# Altium schematic sheet I2C_Shield.SchDoc: I2C_Shield
size A3; Date: 23.01.2025; CheckedBy: Enes Şen; Author: Enes Şen; DrawnBy: Enes Şen; Engineer: Enes Şen; Address1: Balıkesir; DocumentNumber: 1; Revision: 1.0; SheetNumber: 1; SheetTotal: 1; Time: 18:19; ImagePath: 1; Rule: UNIONINDEX=0|RULEKIND=Clearance|NETSCOPE=DifferentNets|LAYERKIND=SameLayer|NAME=Schematic Clearance Constraint|GAP=10mil|GENERICCLEARANCE=10mil|IGNOREPADTOPADCLEARANCEINFOOTPRINT=FALSE|OBJECTCLEARANCES= |UNIT=Imperial
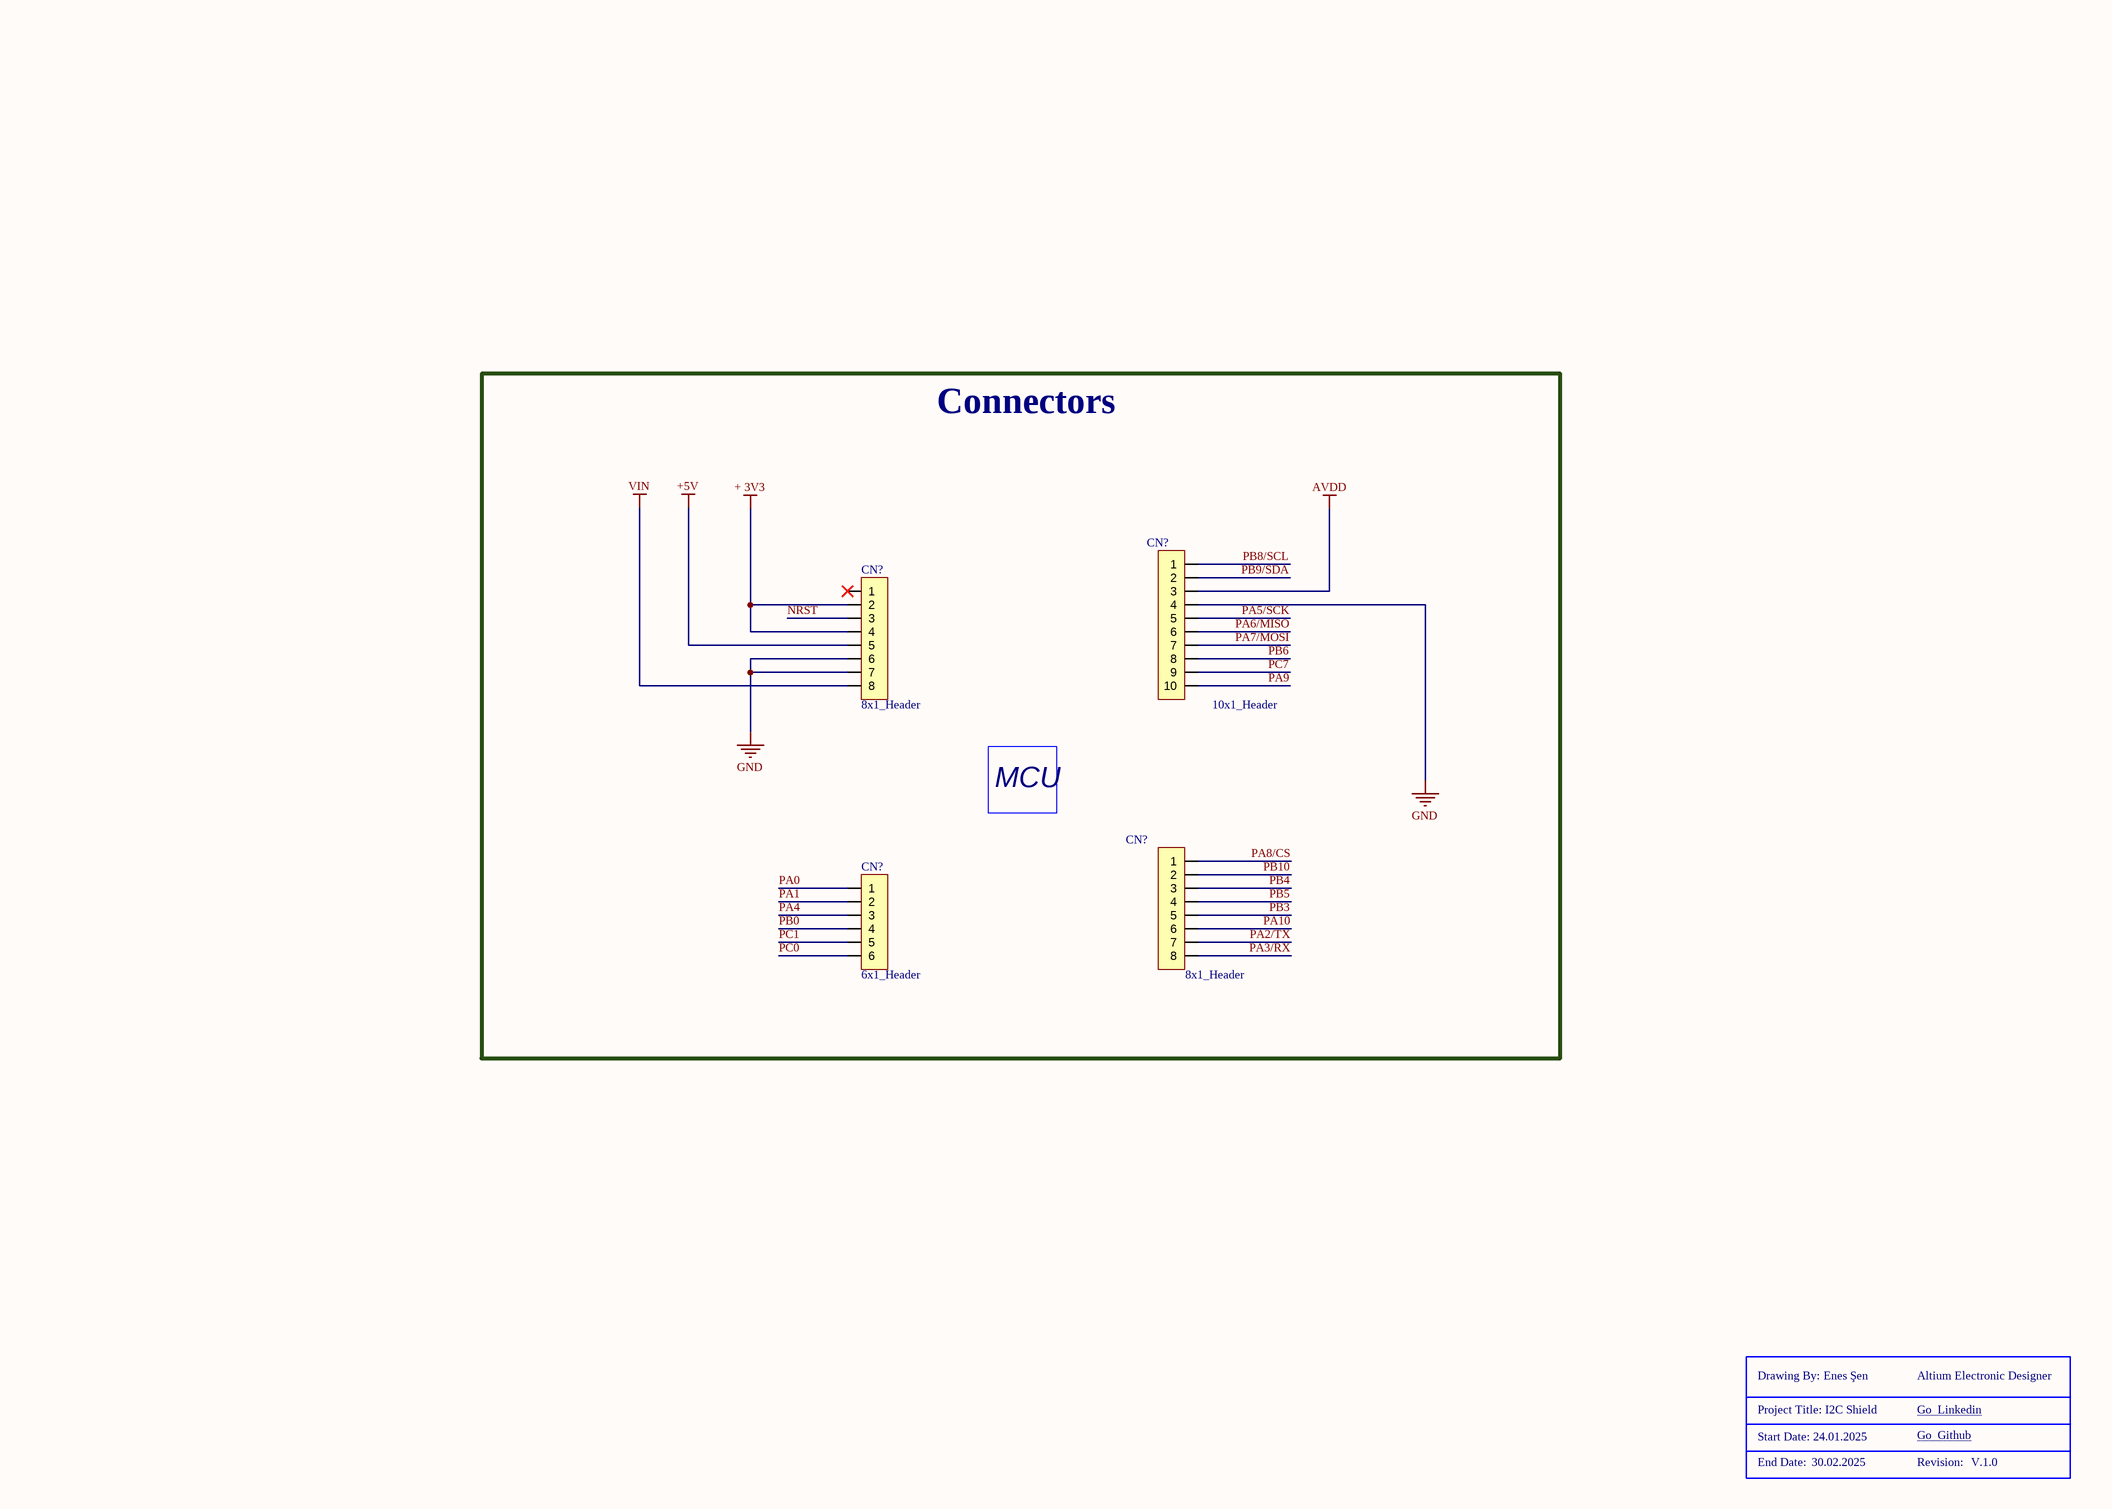
[diagram p0: I2C_Shield.SchDoc]

## Parts
(Parts that share a designator on the sheet are numbered #1, #2 ... from top to bottom, then left to right.)
*  Title_Block  (value not drawn)  (graphical)
CN?#1  Header_10*1_2.54_2  (value not drawn)
CN?#2  Header_8*1_2.54  (value not drawn)
CN?#3  Header_8*1_2.54  (value not drawn)
CN?#4  Header_6*1_2.54  (value not drawn)

## Blocks framed on the sheet
Connectors: CN?#1-CN?#4

## Nets
+5V: CN?#2.5
+ 3V3: CN?#2.2 CN?#2.4
AVDD: CN?#1.3
GND: CN?#1.4 CN?#2.6 CN?#2.7
VIN: CN?#2.8
NRST: CN?#2.3
PA0: CN?#4.1
PA1: CN?#4.2
PA2/TX: CN?#3.7
PA3/RX: CN?#3.8
PA4: CN?#4.3
PA5/SCK: CN?#1.5
PA6/MISO: CN?#1.6
PA7/MOSI: CN?#1.7
PA8/CS: CN?#3.1
PA9: CN?#1.10
PA10: CN?#3.6
PB0: CN?#4.4
PB3: CN?#3.5
PB4: CN?#3.3
PB5: CN?#3.4
PB6: CN?#1.8
PB8/SCL: CN?#1.1
PB9/SDA: CN?#1.2
PB10: CN?#3.2
PC0: CN?#4.6
PC1: CN?#4.5
PC7: CN?#1.9

Not connected (* = marked no-connect by the designer): CN?#2 1*

## Notes on the sheet
- MCU
- DWG. NO.
- REV.
- SHT.
- THIS DOCUMENT AND THE DATA DISCLOSED HEREIN OR HEREWITH IS THE PROPERTY OF ALTIUM LIMITED AND MAY BE FREELY DISTRIBUTED IN WHOLE. NO RIGHTS ARE RESERVED OR EXPRESS OR IMPLIED WARANTEE GIVEN.
- REVISION
- DESCRIPTION
- DATE
- APPROVED
- ENG:
- APPROVALS
- PROJECT
- DSN:
- CHK:
- REFERENCE DOCUMENTS
- PROJECT REVISION:
- TITLE
- DOCUMENT REVISION:
- DESIGN ITEM:
- BOM:
- FAB DWG:
- PCB DWG:
- ASSY DWG:
- SCALE:
- SIZE
- B
- CAGE CODE
- FILE NAME
- DWG NO.
- SHEET
- OF
- REV
- (in symbol Header_6*1_2.54_1) 6x1_Header
- (in symbol Header_8*1_2.54) 8x1_Header
- (in symbol Header_10*1_2.54_2) 10x1_Header
- (in symbol Title_Block) Drawing By:; Enes Şen; Altium Electronic Designer; Project Title:; I2C Shield; Go  Linkedin; Start Date:; 24.01.2025; Go  Github; End Date:; 30.02.2025; Revision:; V.1.0

## Library data of the parts
CN?#4 = Header_6*1_2.54_1